# Altium project Raspi_-Sensors.PrjPcb
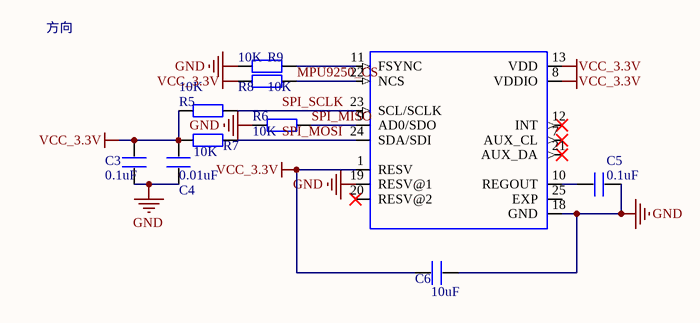
[diagram p0: 9250.SchDoc]
5 sheets, 66 parts. Net scope: global (net labels, ports and power ports of the same name join across sheets).
Board file: MAIN.PcbDoc
Sheets:
  9250.SchDoc
  HMC5883L.SchDoc
  MS5611.SchDoc
  PCA9685.SchDoc
  Rpi_GPIO.SchDoc

## Sheet 9250.SchDoc
size A4

### Parts
C3  0.1uF  [0805]
C4  0.01uF  [0805]
C5  0.1uF  [0805]
C6  10uF  [0805]
R5  value 10K  [0805]  (hidden comment: Res2)
R6  value 10K  [0805]  (hidden comment: Res2)
R7  value 10K  [0805]  (hidden comment: Res2)
R8  value 10K  [0805]  (hidden comment: Res2)
R9  value 10K  [0805]  (hidden comment: Res2)
U9250  MPU-9250  [QFN40P300X300X105-25N]  (value not drawn)

### Nets
GND: C3.1 C4.1 C5.1 C6.1 R6.2 R9.1 U9250.18(GND) U9250.19(RESV@1)
VCC_3.3V: C3.2 C4.2 C6.2 R5.1 R7.1 R8.1 U9250.1(RESV) U9250.8(VDDIO) U9250.13(VDD)
MPU9250_CS: R8.2 U9250.22(NCS)
SPI_MISO: R6.1 U9250.9(AD0/SDO)
SPI_MOSI: R7.2 U9250.24(SDA/SDI)
SPI_SCLK: R5.2 U9250.23(SCL/SCLK)
NetC5_2: C5.2 U9250.10(REGOUT)
NetR9_2: R9.2 U9250.11(FSYNC)

Not connected (* = marked no-connect by the designer): U9250 7(AUX_CL)* 12(INT)* 20(RESV@2)* 21(AUX_DA)* 25(EXP)

### Notes on the sheet
- 方向

### Library data of the parts
C3-C6 = C
R5-R9 = Res2: Resistor; Published: 8-Jun-2000; LatestRevisionDate: 17-Jul-2002; LatestRevisionNote: Re-released for DXP Platform.; PackageReference: AXIAL-0.4; Publisher: Altium Limited; PackageDescription: Axial Device, Thru-Hole; 2 Leads; 0.4 in Pin Spacing
U9250 = MPU-9250: Value: *

## Sheet HMC5883L.SchDoc
size A4
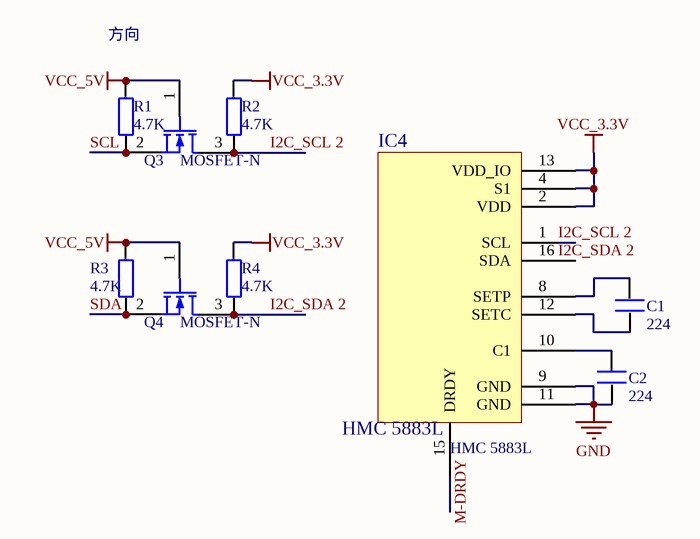
[diagram p1: HMC5883L.SchDoc]

### Parts
C1  224  [0805]
C2  224  [0805]
HMC_5883L  HMC 5883L  [PCBComponent_1]  (value not drawn)
Q3  MOSFET-N  [SOT-343_N]
Q4  MOSFET-N  [SOT-343_N]
R1  value 4.7K  [0805]  (hidden comment: Res2)
R2  value 4.7K  [0805]  (hidden comment: Res2)
R3  value 4.7K  [0805]  (hidden comment: Res2)
R4  value 4.7K  [0805]  (hidden comment: Res2)

### Nets
GND: C2.1 HMC_5883L.9(GND) HMC_5883L.11(GND)
VCC_3.3V: HMC_5883L.2(VDD) HMC_5883L.4(S1) HMC_5883L.13(VDD_IO) R2.2 R4.2
VCC_5V: Q3.1(G) Q4.1(G) R1.2 R3.2
I2C_SCL 2: HMC_5883L.1(SCL) Q3.3(D) R2.1
I2C_SDA 2: Q4.3(D) R4.1
SCL: Q3.2(S) R1.1
SDA: Q4.2(S) R3.1
NetC1_1: C1.1 HMC_5883L.12(SETC)
NetC1_2: C1.2 HMC_5883L.8(SETP)
NetC2_2: C2.2 HMC_5883L.10(C1)

Not connected (* = marked no-connect by the designer): HMC_5883L 15(DRDY) 16(SDA)

### Notes on the sheet
- 方向
- Labels drawn without touching a wire or pin: I2C_SDA 2, M-DRDY
- (in symbol HMC 5883L) IC4

### Library data of the parts
C1 C2 = C
Q3 Q4 = MOSFET-N1: MOSFET; Published: 8-Jun-2000; LatestRevisionDate: 17-Jul-2002; LatestRevisionNote: Re-released for DXP Platform.; PackageVersion: 1995/1996; PackageReference: E3; Publisher: Altium Limited
R1-R4 = Res2: Resistor; Published: 8-Jun-2000; LatestRevisionDate: 17-Jul-2002; LatestRevisionNote: Re-released for DXP Platform.; PackageReference: AXIAL-0.4; Publisher: Altium Limited; PackageDescription: Axial Device, Thru-Hole; 2 Leads; 0.4 in Pin Spacing

## Sheet MS5611.SchDoc
size A4
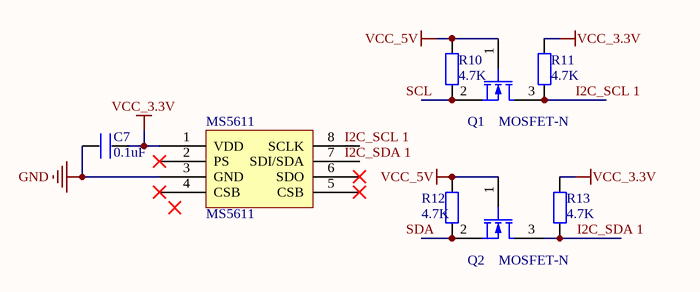
[diagram p2: MS5611.SchDoc]

### Parts
C7  0.1uF  [0805]
MS5611  MS5611  [MS5611]
Q1  MOSFET-N  [SOT-343_N]
Q2  MOSFET-N  [SOT-343_N]
R10  value 4.7K  [0805]  (hidden comment: Res2)
R11  value 4.7K  [0805]  (hidden comment: Res2)
R12  value 4.7K  [0805]  (hidden comment: Res2)
R13  value 4.7K  [0805]  (hidden comment: Res2)

### Nets
GND: C7.2 MS5611.3(GND)
VCC_3.3V: C7.1 MS5611.1(VDD) R11.2 R13.2
VCC_5V: Q1.1(G) Q2.1(G) R10.2 R12.2
I2C_SCL 1: Q1.3(D) R11.1
I2C_SDA 1: Q2.3(D) R13.1
NetQ1_2: Q1.2(S) R10.1
NetQ2_2: Q2.2(S) R12.1

Not connected (* = marked no-connect by the designer): MS5611 2(PS)* 4(CSB)* 5(CSB)* 6(SDO)* 7(SDI/SDA) 8(SCLK)

### Notes on the sheet
- Labels drawn without touching a wire or pin: SCL, SDA

### Library data of the parts
C7 = C
Q1 Q2 = MOSFET-N1: MOSFET; Published: 8-Jun-2000; LatestRevisionDate: 17-Jul-2002; LatestRevisionNote: Re-released for DXP Platform.; PackageVersion: 1995/1996; PackageReference: E3; Publisher: Altium Limited
R10-R13 = Res2: Resistor; Published: 8-Jun-2000; LatestRevisionDate: 17-Jul-2002; LatestRevisionNote: Re-released for DXP Platform.; PackageReference: AXIAL-0.4; Publisher: Altium Limited; PackageDescription: Axial Device, Thru-Hole; 2 Leads; 0.4 in Pin Spacing

## Sheet PCA9685.SchDoc
size A4
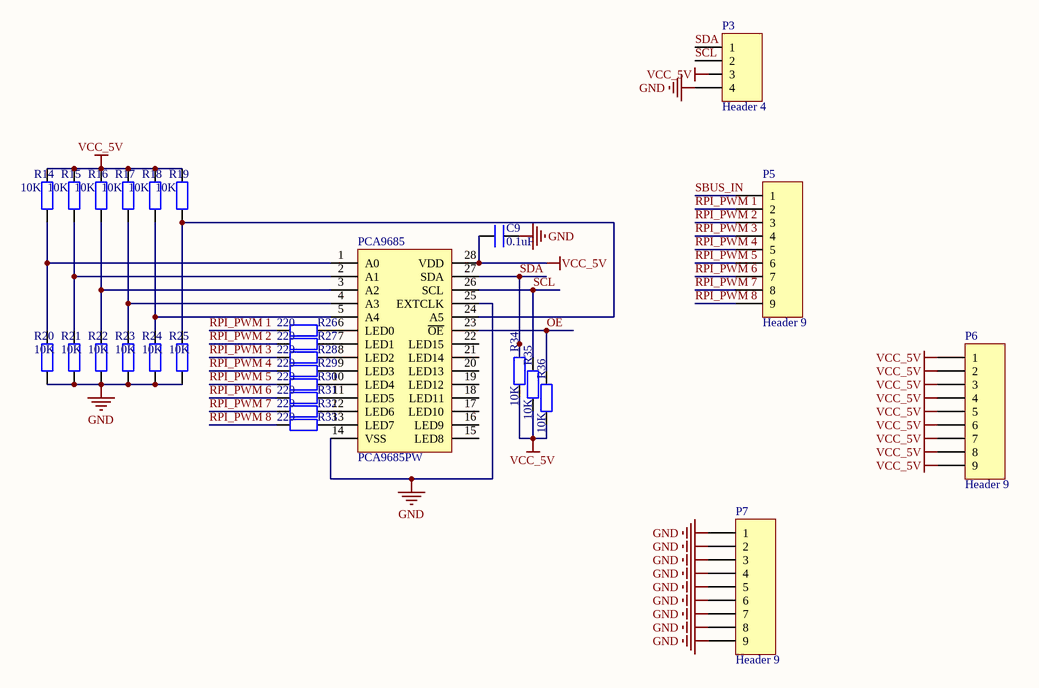
[diagram p3: PCA9685.SchDoc]

### Parts
C9  0.1uF  [0805]
P3  Header 4  [HDR1X4]
P5  Header 9  [HDR1X9]
P6  Header 9  [HDR1X9]
P7  Header 9  [HDR1X9]
PCA9685  PCA9685PW  [PCA9685PW]
R14  value 10K  [0805]  (hidden comment: Res2)
R15  value 10K  [0805]  (hidden comment: Res2)
R16  value 10K  [0805]  (hidden comment: Res2)
R17  value 10K  [0805]  (hidden comment: Res2)
R18  value 10K  [0805]  (hidden comment: Res2)
R19  value 10K  [0805]  (hidden comment: Res2)
R20  value 10K  [0805]  (hidden comment: Res2)
R21  value 10K  [0805]  (hidden comment: Res2)
R22  value 10K  [0805]  (hidden comment: Res2)
R23  value 10K  [0805]  (hidden comment: Res2)
R24  value 10K  [0805]  (hidden comment: Res2)
R25  value 10K  [0805]  (hidden comment: Res2)
R26  value 220  [0805]  (hidden comment: Res2)
R27  value 220  [0805]  (hidden comment: Res2)
R28  value 220  [0805]  (hidden comment: Res2)
R29  value 220  [0805]  (hidden comment: Res2)
R30  value 220  [0805]  (hidden comment: Res2)
R31  value 220  [0805]  (hidden comment: Res2)
R32  value 220  [0805]  (hidden comment: Res2)
R33  value 220  [0805]  (hidden comment: Res2)
R34  value 10K  [0805]  (hidden comment: Res2)
R35  value 10K  [0805]  (hidden comment: Res2)
R36  value 10K  [0805]  (hidden comment: Res2)

### Nets
GND: C9.2 P3.4 P7.1 P7.2 P7.3 P7.4 P7.5 P7.6 P7.7 P7.8 P7.9 PCA9685.14(VSS) PCA9685.25(EXTCLK) R20.2 R21.2 R22.2 R23.2 R24.2 R25.2
VCC_5V: C9.1 P6.1 P6.2 P6.3 P6.4 P6.5 P6.6 P6.7 P6.8 P6.9 PCA9685.28(VDD) R14.1 R15.1 R16.1 R17.1 R18.1 R19.1 R34.2 R35.2 R36.2
OE: PCA9685.23(~{OE}) R36.1
RPI_PWM 1: P5.2 R26.1
RPI_PWM 2: P5.3 R27.1
RPI_PWM 3: P5.4 R28.1
RPI_PWM 4: P5.5 R29.1
RPI_PWM 5: P5.6 R30.1
RPI_PWM 6: P5.7 R31.1
RPI_PWM 7: P5.8 R32.1
RPI_PWM 8: P5.9 R33.1
SBUS_IN: P5.1
SCL: P3.2 PCA9685.26(SCL) R35.1
SDA: P3.1 PCA9685.27(SDA) R34.1
NetPCA9685_1: PCA9685.1(A0) R14.2 R20.1
NetPCA9685_2: PCA9685.2(A1) R15.2 R21.1
NetPCA9685_3: PCA9685.3(A2) R16.2 R22.1
NetPCA9685_4: PCA9685.4(A3) R17.2 R23.1
NetPCA9685_5: PCA9685.5(A4) R18.2 R24.1
NetPCA9685_6: PCA9685.6(LED0) R26.2
NetPCA9685_7: PCA9685.7(LED1) R27.2
NetPCA9685_8: PCA9685.8(LED2) R28.2
NetPCA9685_9: PCA9685.9(LED3) R29.2
NetPCA9685_10: PCA9685.10(LED4) R30.2
NetPCA9685_11: PCA9685.11(LED5) R31.2
NetPCA9685_12: PCA9685.12(LED6) R32.2
NetPCA9685_13: PCA9685.13(LED7) R33.2
NetPCA9685_24: PCA9685.24(A5) R19.2 R25.1

Not connected (* = marked no-connect by the designer): P3 3; PCA9685 15(LED8) 16(LED9) 17(LED10) 18(LED11) 19(LED12) 20(LED13) 21(LED14) 22(LED15)

### Notes on the sheet
- Labels drawn without touching a wire or pin: VCC_5V

### Library data of the parts
C9 = C
P3 = Header 4: Header, 4-Pin; LatestRevisionDate: 17-Jul-2002; LatestRevisionNote: Re-released for DXP Platform.; Publisher: Altium Limited
P5-P7 = Header 9: Header, 9-Pin; LatestRevisionDate: 17-Jul-2002; LatestRevisionNote: Re-released for DXP Platform.; Publisher: Altium Limited
R14-R36 = Res2: Resistor; Published: 8-Jun-2000; LatestRevisionDate: 17-Jul-2002; LatestRevisionNote: Re-released for DXP Platform.; PackageReference: AXIAL-0.4; Publisher: Altium Limited; PackageDescription: Axial Device, Thru-Hole; 2 Leads; 0.4 in Pin Spacing

## Sheet Rpi_GPIO.SchDoc
size A4
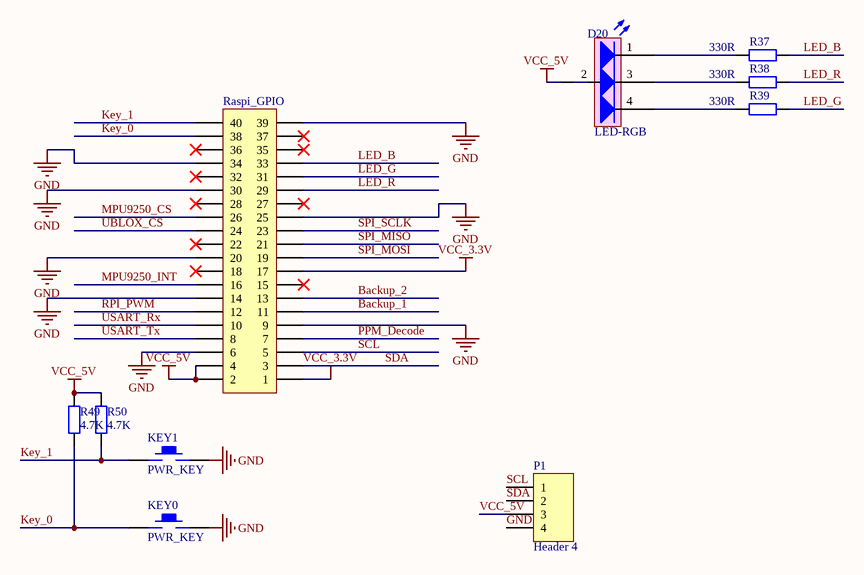
[diagram p4: Rpi_GPIO.SchDoc]

### Parts
D20  LED-RGB  [LED_5050_RGB]
KEY0  PWR_KEY  [KEY_M]
KEY1  PWR_KEY  [KEY_M]
P1  Header 4  [HDR1X4]
R37  value 330R  [0805]  (hidden comment: Res2)
R38  value 330R  [0805]  (hidden comment: Res2)
R39  value 330R  [0805]  (hidden comment: Res2)
R49  value 4.7K  [0805]  (hidden comment: Res2)
R50  value 4.7K  [0805]  (hidden comment: Res2)
Raspi_GPIO  Header 20X2  [HDR2X20]  (value not drawn)

### Nets
GND: KEY0.2 KEY1.2 P1.4 Raspi_GPIO.6 Raspi_GPIO.9 Raspi_GPIO.14 Raspi_GPIO.20 Raspi_GPIO.25 Raspi_GPIO.30 Raspi_GPIO.34 Raspi_GPIO.39
VCC_3.3V: Raspi_GPIO.1 Raspi_GPIO.17
VCC_5V: D20.2(A) P1.3 R49.1 R50.1 Raspi_GPIO.2 Raspi_GPIO.4
Backup_1: Raspi_GPIO.11
Backup_2: Raspi_GPIO.13
Key_0: KEY0.1 R49.2 Raspi_GPIO.38
Key_1: KEY1.1 R50.2 Raspi_GPIO.40
LED_B: R37.1 Raspi_GPIO.33
LED_G: R39.1 Raspi_GPIO.31
LED_R: R38.1 Raspi_GPIO.29
MPU9250_CS: Raspi_GPIO.26
MPU9250_INT: Raspi_GPIO.16
PPM_Decode: Raspi_GPIO.7
RPI_PWM: Raspi_GPIO.12
SCL: P1.1 Raspi_GPIO.5
SDA: P1.2 Raspi_GPIO.3
SPI_MISO: Raspi_GPIO.21
SPI_MOSI: Raspi_GPIO.19
SPI_SCLK: Raspi_GPIO.23
UBLOX_CS: Raspi_GPIO.24
USART_Rx: Raspi_GPIO.10
USART_Tx: Raspi_GPIO.8
NetD20_1: D20.1(R) R37.2
NetD20_3: D20.3(G) R38.2
NetD20_4: D20.4(B) R39.2

Not connected (* = marked no-connect by the designer): Raspi_GPIO 15* 18* 22* 27* 28* 32* 35* 36* 37*

### Library data of the parts
D20 = LED-RGB: 三基色LED; pin to pad: 1>K1 2>A 3>K2 4>K3; Published: 8-Jun-2000; LatestRevisionDate: 08-Jul-2005; LatestRevisionNote: Mech Layer 1 removed.; PackageReference: LED-0; Publisher: Altium Limited
KEY0 KEY1 = KEY_M
P1 = Header 4: Header, 4-Pin; LatestRevisionDate: 17-Jul-2002; LatestRevisionNote: Re-released for DXP Platform.; Publisher: Altium Limited
R37-R39 R49 R50 = Res2: Resistor; Published: 8-Jun-2000; LatestRevisionDate: 17-Jul-2002; LatestRevisionNote: Re-released for DXP Platform.; PackageReference: AXIAL-0.4; Publisher: Altium Limited; PackageDescription: Axial Device, Thru-Hole; 2 Leads; 0.4 in Pin Spacing
Raspi_GPIO = Header 20X2: Header, 20-Pin, Dual row; LatestRevisionDate: 17-Jul-2002; LatestRevisionNote: Re-released for DXP Platform.; Publisher: Altium Limited

## Nets that join several sheets
GND: 9250 (8 pins), HMC5883L (C2.1 HMC_5883L.9 HMC_5883L.11), MS5611 (C7.2 MS5611.3), PCA9685 (19 pins), Rpi_GPIO (11 pins)
VCC_3.3V: 9250 (9 pins), HMC5883L (5 pins), MS5611 (C7.1 MS5611.1 R11.2 R13.2), Rpi_GPIO (Raspi_GPIO.1 Raspi_GPIO.17)
VCC_5V: HMC5883L (Q3.1 Q4.1 R1.2 R3.2), MS5611 (Q1.1 Q2.1 R10.2 R12.2), PCA9685 (20 pins), Rpi_GPIO (6 pins)
MPU9250_CS: 9250 (R8.2 U9250.22), Rpi_GPIO (Raspi_GPIO.26)
SCL: HMC5883L (Q3.2 R1.1), PCA9685 (P3.2 PCA9685.26 R35.1), Rpi_GPIO (P1.1 Raspi_GPIO.5)
SDA: HMC5883L (Q4.2 R3.1), PCA9685 (P3.1 PCA9685.27 R34.1), Rpi_GPIO (P1.2 Raspi_GPIO.3)
SPI_MISO: 9250 (R6.1 U9250.9), Rpi_GPIO (Raspi_GPIO.21)
SPI_MOSI: 9250 (R7.2 U9250.24), Rpi_GPIO (Raspi_GPIO.19)
SPI_SCLK: 9250 (R5.2 U9250.23), Rpi_GPIO (Raspi_GPIO.23)